# EAGLE schematic sparkfun-samd21-mini-breakout (EAGLE 7.1.0)
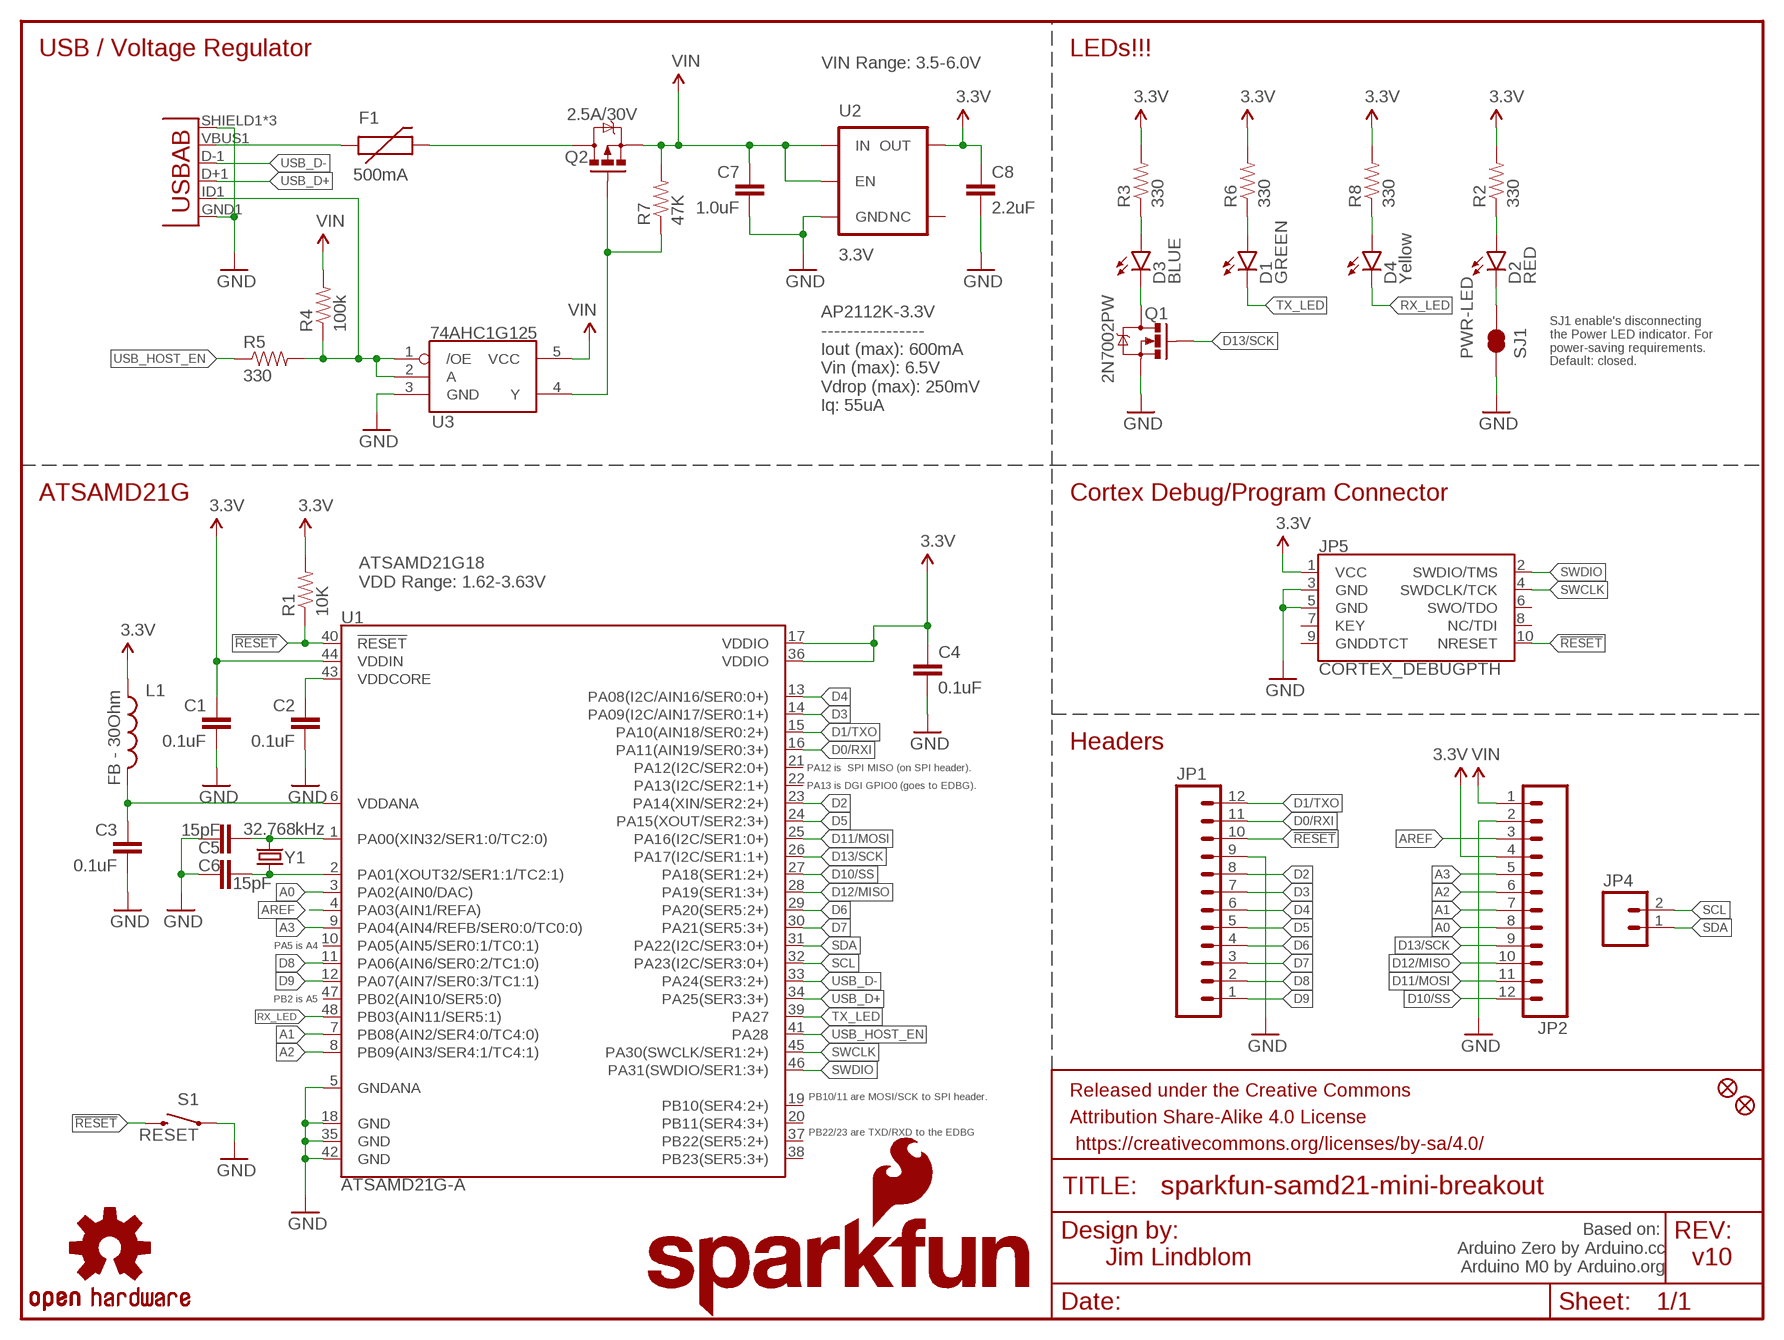
[diagram p0: schematic, sheet 1]

## Parts
C1  0.1uF  0.1UF-16V(+-10%)(0402)  [0402-CAP]
C2  0.1uF  0.1UF-16V(+-10%)(0402)  [0402-CAP]
C3  0.1uF  0.1UF-16V(+-10%)(0402)  [0402-CAP]
C4  0.1uF  0.1UF-16V(+-10%)(0402)  [0402-CAP]
C5  15pF  15PF-50V(+-5%)(0402)  [0402-CAP]
C6  15pF  15PF-50V(+-5%)(0402)  [0402-CAP]
C7  1.0uF  1.0UF-25V-+80/-20(0805)"  [0805-CAP]
C8  2.2uF  2.2UF-10V-20%(0603)  [0603-CAP]
D1  GREEN  LED-GREEN0603  [LED-0603]
D2  RED  LED-RED0603  [LED-0603]
D3  BLUE  LED-BLUE0603  [LED-0603]
D4  Yellow  LED-YELLOW0603  [LED-0603]
F1  500mA  PTCSMD  [PTC-1206]
FID1  FIDUCIAL1X2  [FIDUCIAL-1X2]
FID2  FIDUCIAL1X2  [FIDUCIAL-1X2]
FRAME1  FRAME-LETTER  [CREATIVE_COMMONS]
JP1  M12NO_SILK  [1X12_NO_SILK]
JP2  M12NO_SILK  [1X12_NO_SILK]
JP3  USB-ABCONN-11794  [USB-AB-MICRO-SMD_V03]
JP4  M021X02_NO_SILK  [1X02_NO_SILK]
JP5  CORTEX_DEBUGPTH  [2X5-PTH-1.27MM]
L1  FB - 30Ohm  INDUCTOR0603  [0603]
LOGO1  SFE_LOGO_FLAME.1_INCH  [SFE_LOGO_FLAME_.1]
LOGO2  OSHW-LOGOS  [OSHW-LOGO-S]
LOGO3  SFE_LOGO_NAME_FLAME.1_INCH  [SFE_LOGO_NAME_FLAME_.1]
Q1  2N7002PW  MOSFET-NCHANNEL2N7002PW  [SOT323]
Q2  2.5A/30V  MOSFET-PCHANNELDMG2307L  [SOT23-3]
R1  10K  10KOHM-1/10W-1%(0603)0603  [0603-RES]
R2  330  330OHM1/10W1%(0603)  [0603-RES]
R3  330  330OHM1/10W1%(0603)  [0603-RES]
R4  100k  100KOHM-1/10W-1%(0603)  [0603-RES]
R5  330  330OHM1/10W1%(0603)  [0603-RES]
R6  330  330OHM1/10W1%(0603)  [0603-RES]
R7  47K  47KOHM1/10W1%(0603)  [0603-RES]
R8  330  330OHM1/10W1%(0603)  [0603-RES]
S1  RESET  SWITCH-MOMENTARY-2SMD-4.6X2.8MM  [TACTILE_SWITCH_SMD_4.6X2.8MM]
SJ1  PWR-LED  JUMPER-PAD-2-NC_BY_TRACENO_SILK  [PAD-JUMPER-2-NC_BY_TRACE_NO_SILK]
U1  ATSAMD21G-A  [TQFP-48]
U2  3.3V  V_REG_AP2112K-3.3V  [SOT23-5]
U3  74AHC1G125  [SOT23-5]
Y1  32.768kHz  CRYSTAL3.2X1.5MM  [CRYSTAL-SMD-3.2X1.5MM]

## Nets
3.3V: C1.1 C4.1 C8.1 JP2.4 JP5.1(VCC) L1.1 R1.2 R2.2 R3.2 R6.2 R8.2 U1.17(VDDIO) U1.36(VDDIO) U1.44(VDDIN) U2.5(OUT)
!RESET: JP1.10 JP5.10(NRESET) R1.1 S1.3 S1.4 U1.40(!RESET!)
A0: JP2.8 U1.3(PA02(AIN0/DAC))
A1: JP2.7 U1.7(PB08(AIN2/SER4:0/TC4:0))
A2: JP2.6 U1.8(PB09(AIN3/SER4:1/TC4:1))
A3: JP2.5 U1.9(PA04(AIN4/REFB/SER0:0/TC0:0))
AREF: JP2.3 U1.4(PA03(AIN1/REFA))
D0/RXI: JP1.11 U1.16(PA11(AIN19/SER0:3+))
D1/TXO: JP1.12 U1.15(PA10(AIN18/SER0:2+))
D2: JP1.8 U1.23(PA14(XIN/SER2:2+))
D3: JP1.7 U1.14(PA09(I2C/AIN17/SER0:1+))
D4: JP1.6 U1.13(PA08(I2C/AIN16/SER0:0+))
D5: JP1.5 U1.24(PA15(XOUT/SER2:3+))
D6: JP1.4 U1.29(PA20(SER5:2+))
D7: JP1.3 U1.30(PA21(SER5:3+))
D8: JP1.2 U1.11(PA06(AIN6/SER0:2/TC1:0))
D9: JP1.1 U1.12(PA07(AIN7/SER0:3/TC1:1))
D10/SS: JP2.12 U1.27(PA18(SER1:2+))
D11/MOSI: JP2.11 U1.25(PA16(I2C/SER1:0+))
D12/MISO: JP2.10 U1.28(PA19(SER1:3+))
D13/SCK: JP2.9 Q1.1(G) U1.26(PA17(I2C/SER1:1+))
GND: C1.2 C2.2 C3.2 C4.2 C5.1 C6.2 C7.2 C8.2 JP1.9 JP2.2 JP3.GND1(GND) JP3.SHIELD1(SHIELD) JP3.SHIELD2(SHIELD) JP3.SHIELD3(SHIELD) JP5.3(GND) JP5.5(GND) Q1.2(S) S1.1 S1.2 SJ1.1 U1.5(GNDANA) U1.18(GND) U1.35(GND) U1.42(GND) U2.2(GND) U3.3(GND)
N$1: F1.1 JP3.VBUS1(VBUS)
N$2: C5.2 U1.1(PA00(XIN32/SER1:0/TC2:0)) Y1.P$2
N$3: D3.C Q1.3(D)
N$4: C6.1 U1.2(PA01(XOUT32/SER1:1/TC2:1)) Y1.P$1
N$5: D2.A R2.1
N$6: D3.A R3.1
N$7: F1.2 Q2.3(D)
N$8: JP3.ID1(USBID) R4.1 R5.2 U3.1(/OE) U3.2(A)
N$9: Q2.1(G) R7.1 U3.4(Y)
N$10: D1.A R6.1
N$11: D4.A R8.1
N$12: D2.C SJ1.2
RX_LED: D4.C U1.48(PB03(AIN11/SER5:1))
SCL: JP4.2 U1.32(PA23(I2C/SER3:0+))
SDA: JP4.1 U1.31(PA22(I2C/SER3:0+))
SWCLK: JP5.4(SWDCLK/TCK) U1.45(PA30(SWCLK/SER1:2+))
SWDIO: JP5.2(SWDIO/TMS) U1.46(PA31(SWDIO/SER1:3+))
TX_LED: D1.C U1.39(PA27)
USB_D+: JP3.D+1(D+) U1.34(PA25(SER3:3+))
USB_D-: JP3.D-1(D-) U1.33(PA24(SER3:2+))
USB_HOST_EN: R5.1 U1.41(PA28)
VDDANA: C3.1 L1.2 U1.6(VDDANA)
VDDCORE: C2.1 U1.43(VDDCORE)
VIN: C7.1 JP2.1 Q2.2(S) R4.2 R7.2 U2.1(IN) U2.3(EN) U3.5(VCC)
Unconnected: JP5.6(SWO/TDO) JP5.7(KEY) JP5.8(NC/TDI) JP5.9(GNDDTCT) U1.10(PA05(AIN5/SER0:1/TC0:1)) U1.19(PB10(SER4:2+)) U1.20(PB11(SER4:3+)) U1.21(PA12(I2C/SER2:0+)) U1.22(PA13(I2C/SER2:1+)) U1.37(PB22(SER5:2+)) U1.38(PB23(SER5:3+)) U1.47(PB02(AIN10/SER5:0)) U2.4(NC)

## Notes on the sheet
- USB / Voltage Regulator | LEDs!!!
- VIN Range: 3.5-6.0V
- AP2112K-3.3V
  ----------------
  Iout (max): 600mA 
  Vin (max): 6.5V
  Vdrop (max): 250mV
  Iq: 55uA
- SJ1 enable's disconnecting
  the Power LED indicator. For
  power-saving requirements.
  Default: closed.
- ATSAMD21G | Cortex Debug/Program Connector
- ATSAMD21G18
  VDD Range: 1.62-3.63V
- Headers
- PA12 is  SPI MISO (on SPI header).
- PA13 is DGI GPIO0 (goes to EDBG).
- PA5 is A4
- PB2 is A5
- PB10/11 are MOSI/SCK to SPI header.
- PB22/23 are TXD/RXD to the EDBG
- Based on: 
  Arduino Zero by Arduino.cc
  Arduino M0 by Arduino.org
- Jim Lindblom | v10

## Library data of the parts
C1-C4 = SparkFun-Capacitors:0.1UF-16V(+-10%)(0402); PROD_ID: CAP-12416
C5 C6 = samd21-temp:15PF-50V(+-5%)(0402); PROD_ID: CAP-13063
C7 = SparkFun-Capacitors:1.0UF-25V-+80/-20(0805): CAP-11625; PROD_ID: CAP-11625
C8 = SparkFun-Capacitors:2.2UF-10V-20%(0603): CAP-07888; PROD_ID: CAP-07888
D1 = SparkFun-LED:LED-GREEN: Various green LEDs Green LEDs used in SFE Production 0603- DIO-00821 LARGE- DIO-00862 LILYPAD- DIO-09910; PROD_ID: DIO-00821
D2 = SparkFun-LED:LED-RED: Assorted Red LEDs LilyPad 1206- DIO-09912 1206- DIO-00809 0603- DIO-00819 "SMART" means more efficient and expensive; PROD_ID: DIO-00819
D3 = SparkFun-LED:LED-BLUE: Blue LEDs for production use Various blue LEDs stocked by SparkFun production 0603 - DIO-08575 Rebel - DIO-09553 1206 - DIO-09911; PROD_ID: DIO-08575
D4 = SparkFun-LED:LED-YELLOW: Yellow SMD LEDs LilyPad 1206- DIO-09909 0603- DIO-09003 "SMART" means more efficient and expensive; PROD_ID: DIO-09003
F1 = SparkFun-PowerIC:PTC: Resettable Fuse PTC Resettable Fuse. Spark Fun Electronics SKU : COM-08357; PROD_ID: RES-11150
FID1 FID2 = SparkFun-Aesthetics:FIDUCIAL: Fiducial Alignment Points Various fiducial points for machine vision alignment.
FRAME1 = SparkFun-Aesthetics:FRAME-LETTER: Schematic Frame Standard 8.5x11 US Letter frame
JP1 JP2 = SparkFun-Connectors:M12: Header 12 Standard 12-pin 0.1" header. Use with straight break away headers (SKU : PRT-00116), right angle break away headers (PRT-00553), swiss pins (PRT-00743), machine pins (PRT-00117), and female headers (PRT-00115).
JP3 = SparkFun-Connectors:USB-AB: This is a USB AB connector that is compatible with USB OTG. i.e. this connector can serve as a host or device; PROD_ID: CONN-11794
JP4 = SparkFun-Connectors:M02: Standard 2-pin 0.1" header. Use with - straight break away headers ( PRT-00116) - right angle break away headers (PRT-00553) - swiss pins (PRT-00743) - machine pins (PRT-00117) - female headers (PRT-00115) Molex polarized connector foot print use with: PRT-08233 with associated crimp pins and housings. 2.54_SCREWTERM for use with PRT-10571. 3.5mm Screw Terminal footprints for PRT-08084 5mm Screw Terminal footprints for use with PRT-08432
JP5 = samd21-temp:CORTEX_DEBUG: Cortex Debug Connector Datasheet <http://infocenter.arm.com/help/topic/com.arm.doc.faqs/attached/13634/cortex_debug_connectors.pdf>
L1 = SparkFun-Passives:INDUCTOR: Inductors Basic Inductor/Choke - 0603 and 1206. Footprints are not proven and vary greatly between part numbers. INDUCTOR POWER 3.3UH 4.0A SMD 0.197" L x 0.197" W x 0.177" H (5.00mm x 5.00mm x 4.50mm); PROD_ID: RES-07859
LOGO1 = SparkFun-Aesthetics:SFE_LOGO_FLAME: SFE Logo, flame only This is the SparkFun flame logo. The logo on the schematic will always be the same size; the package variant is the height of the flame. Default layer for the logo on the board is tSilk.
LOGO2 = SparkFun-Aesthetics:OSHW-LOGO: Open Source Hardware Logo This logo indicates the piece of hardware it is found on incorporates a OSHW license and/or adheres to the definition of open source hardware found here: http://freedomdefined.org/OSHW
LOGO3 = SparkFun-Aesthetics:SFE_LOGO_NAME_FLAME: SFE Logo, name and flame This is the SparkFun full logo. The logo on the schematic will always be the same size; the package variant is the height of the flame part of the logo. Default layer for the logo on the board is tSilk.
Q1 = SparkFun-DiscreteSemi:MOSFET-NCHANNEL: Common NMOSFET Parts MFG P/N Store ID Prod ID FDD8780 TRANS-09984 SI7820DN TRANS-11055 FDS6630A IC-08089 2N7002PW TRANS-11151 FQP30N06L COM-10213 TRANS-10060 BSS123LT1G TRANS-08345 BSS138 TRANS-00830 BS170 2N7000; PROD_ID: TRANS-11151
Q2 = SparkFun-DiscreteSemi:MOSFET-PCHANNEL: Generic PMOSFET IRLML2244 - TRANS-11153 (SOT-23 -20V -4.3A) (1.Gate 2.Source 3.Drain) FQP27P06 - COM-10349 <http://www.sparkfun.com/products/10349> (TO-220 -60V -27A) (1.Gate 2.Source 3.Drain); PROD_ID: TRANS-11308
R1 = SparkFun-Resistors:10KOHM-1/10W-1%(0603): RES-00824; PROD_ID: RES-00824
R2 R3 R5 R6 R8 = SparkFun-Resistors:330OHM1/10W1%(0603): RES-00818; PROD_ID: RES-00818
R4 = SparkFun-Resistors:100KOHM-1/10W-1%(0603): RES-07828; PROD_ID: RES-07828
R7 = SparkFun-Resistors:47KOHM1/10W1%(0603): RES-07871; PROD_ID: RES-07871
S1 = samd21-temp:SWITCH-MOMENTARY-2: Various NO switches- pushbuttons, reed, etc; PROD_ID: SWCH-13065
SJ1 = SparkFun-Passives:JUMPER-PAD-2-NC_BY_TRACE
U1 = samd21-temp:ATSAMD21G: Atmel SAMD21G SMART ARM-Based Microcontroller The Atmel ® | SMART ™ SAM D21 is a series of low-power microcontrollers using the 32-bit ARM ® Cortex ® -M0+ processor, and ranging from 32- to 64-pins with up to 256KB Flash and 32KB of SRAM. The SAM D21 devices operate at a maximum frequency of 48MHz and reach 2.46 CoreMark/MHz. They are designed for simple and intuitive migration with identical peripheral modules, hex compatible code, identical linear address map and pin compatible migration paths between all devices in the product series. All devices include intelligent and flexible peripherals, Atmel Event System for inter-peripheral signaling, and support for capacitive touch button, slider and wheel user interfaces.; PROD_ID: IC-13064
U2 = SparkFun-PowerIC:V_REG_AP2112: AP2112 - 600mA CMOS LDO Regulator w/ Enable The AP2112 is CMOS process low dropout linear regulator with enable function, the regulator delivers a guaranteed 600mA (min.) continuous load current. Features Output Voltage Accuracy: ±1.5% Output Current: 600mA (Min.) Foldback Short Current Protection: 50mA Enable Function to Turn ON/OFF VOUT Low Dropout Voltage (3.3V): 250mV (Typ.) @IOUT=600mA Excellent Load Regulation: 0.2%/A (Typ.) Excellent Line Regulation: 0.02%/V (Typ.) Low Quiescent Current: 55μA (Typ.) Low Standby Current: 0.01μA (Typ.) Low Output Noise: 50μVRMS PSRR: 100Hz -65dB, 1kHz -65dB OTSD Protection Stable with 1.0μF Flexible Cap: Ceramic, Tantalum and Aluminum Electrolytic Operation Temperature Range: -40°C to 85°C ESD: MM 400V, HBM 4000V; PROD_ID: VREG-12457
U3 = SparkFun-DigitalIC:74AHC1G125: Single bus buffer gate with 3-state output; PROD_ID: IC-11920
Y1 = samd21-temp:CRYSTAL: Various standard crystals. Proven footprints.; PROD_ID: XTAL-13062